# Altium schematic sheet [10] FPGA_ADC_S.SchDoc: FPGA ADC South
size 393 x 281 mm; SheetNumber: 10; SheetTotal: 21; PageSetup: Record=PageOptions|CenterHorizontal=True|CenterVertical=True|PrintScale=0.94|XCorrection=0.00|YCorrection=0.00|PrintKind=0|BorderSize=5000000|LeftOffset=0|BottomOffset=0|Orientation=2|PaperLength=1000|PaperWidth=1000|Scale=100|PaperSource=15|PrintQuality=600|MediaType=1|DitherType=10|PrintScaleMode=1|PaperKind=A4; Adr1: August Barks gata 6B; Adr2: SE-421 32 Västra Frölunda; Adr3: Sweden; Webpage: www.omnisys.se
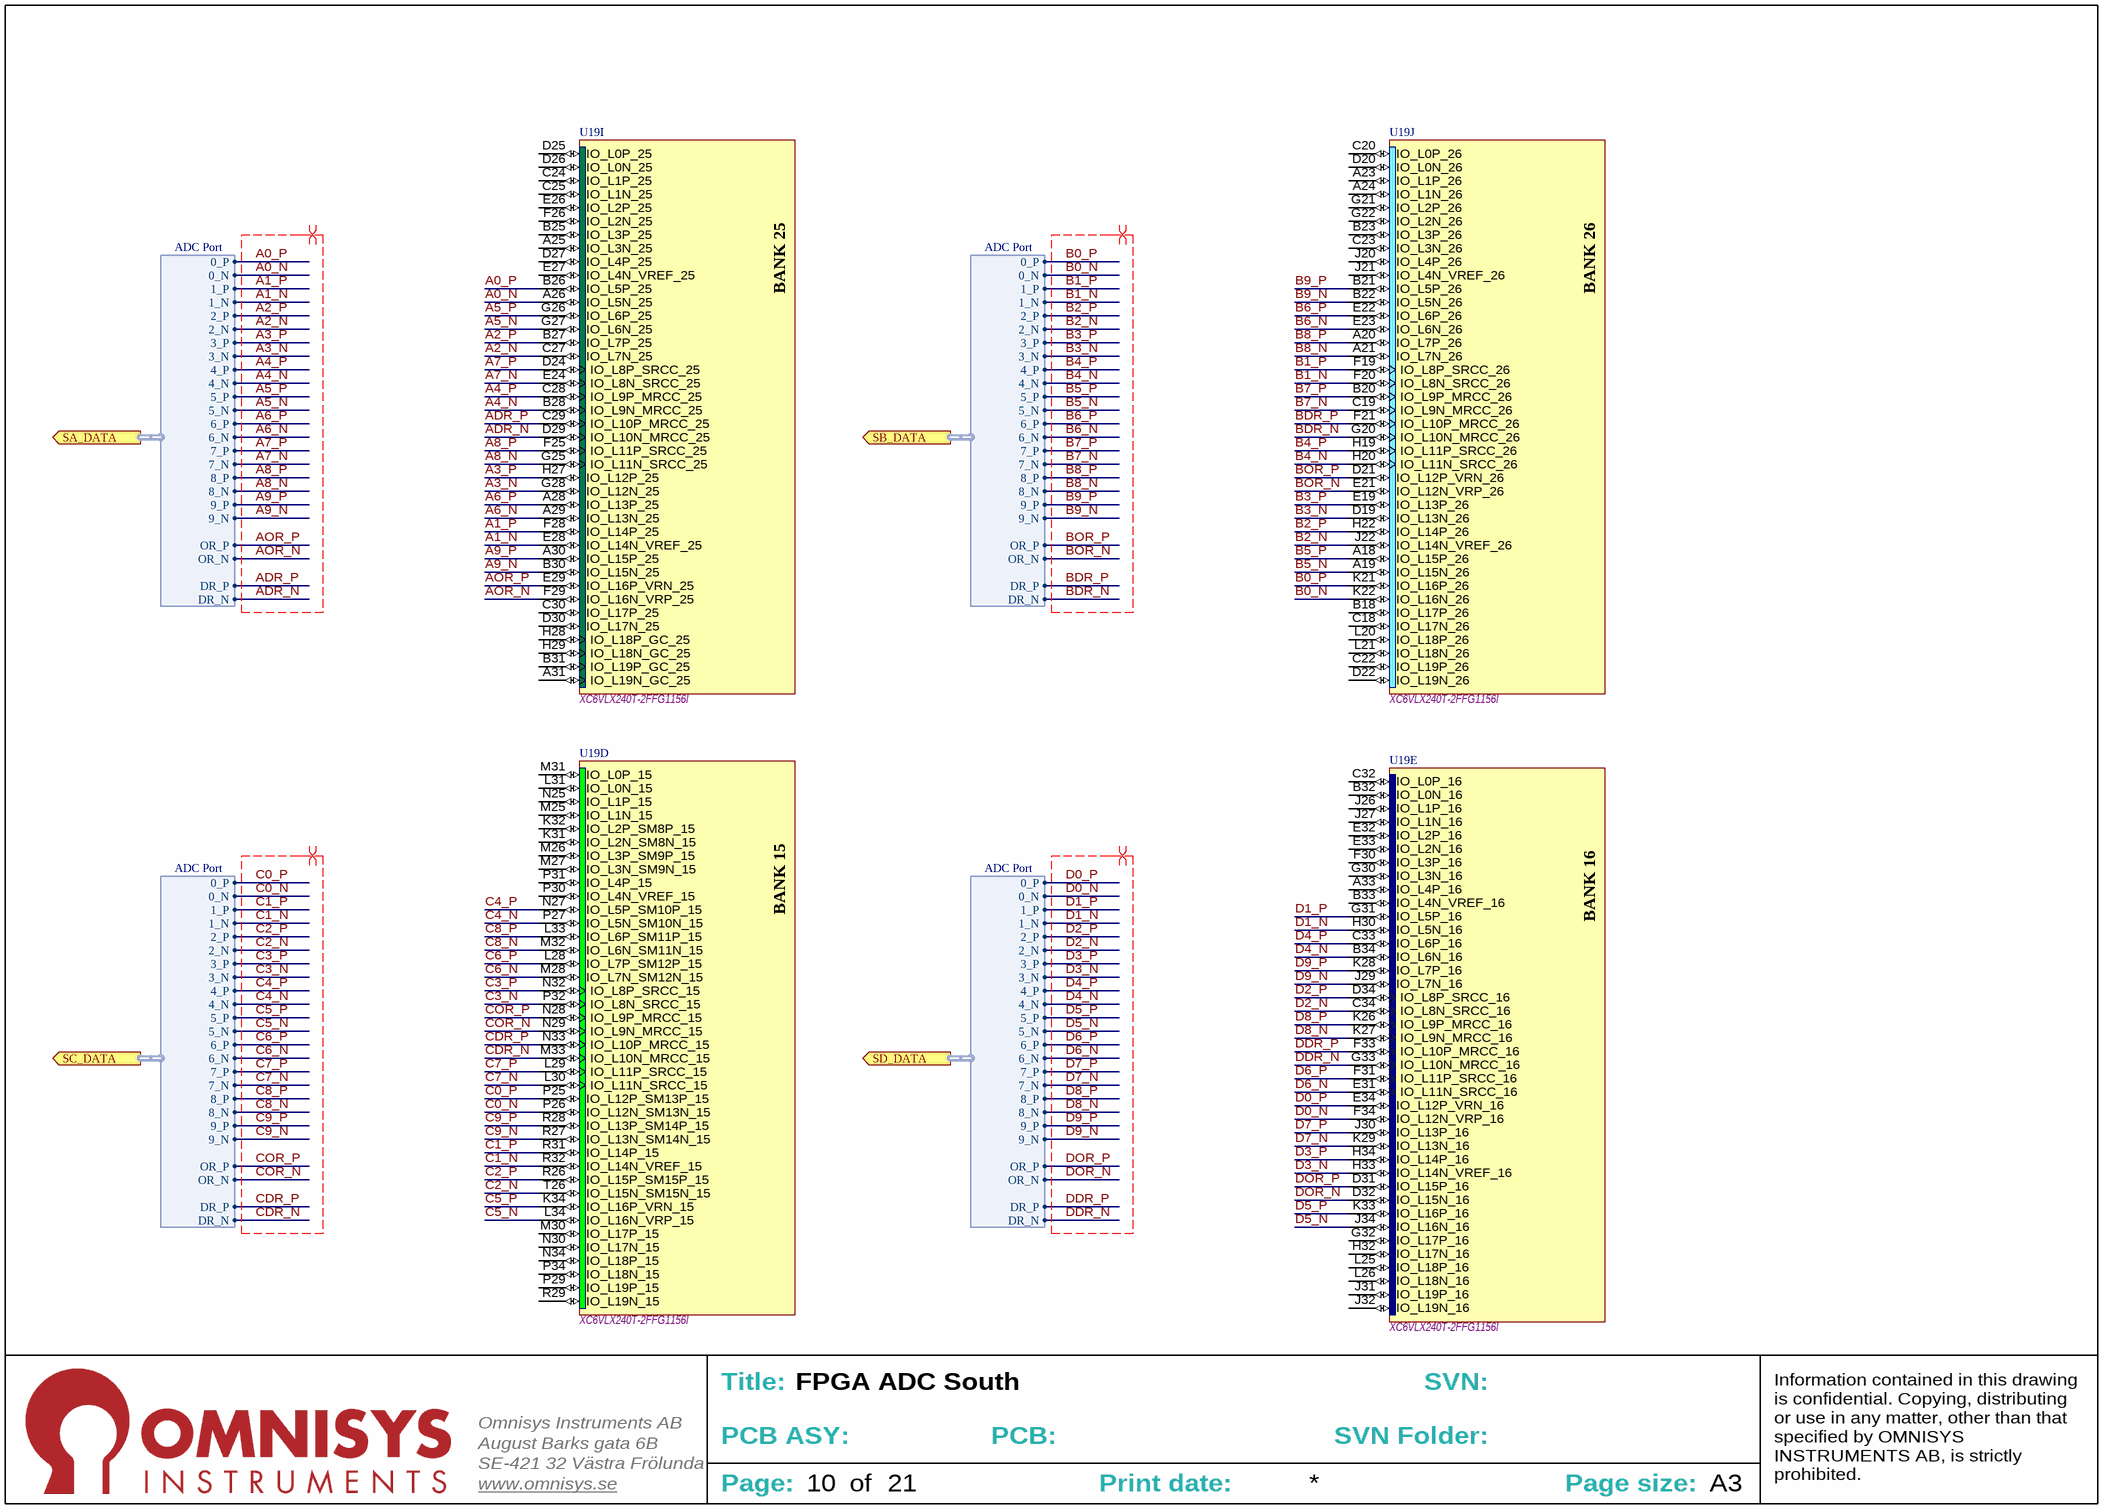
[diagram p0: [10] FPGA_ADC_S.SchDoc]

## Parts
U19  XC6VLX240T-2FFG1156I  [FFG1156]  (parts D,E,I,J of 20)

## Ports
SA_DATA (out, harness ADC Port), SB_DATA (out, harness ADC Port), SC_DATA (out, harness ADC Port), SD_DATA (out, harness ADC Port)

## Harnesses
ADC Port: 0_P, 1_P, 2_P, 3_P, 4_P, 5_P, 6_P, 7_P, 8_P, 9_P, 0_N, 1_N, 2_N, 3_N, 4_N, 5_N, 6_N, 7_N, 8_N, 9_N, OR_P, OR_N, DR_P, DR_N

## Nets
A0_N: U19.A26(IO_L5N_25) ; port SA_DATA.0_N
A0_P: U19.B26(IO_L5P_25) ; port SA_DATA.0_P
A1_N: U19.E28(IO_L14N_VREF_25) ; port SA_DATA.1_N
A1_P: U19.F28(IO_L14P_25) ; port SA_DATA.1_P
A2_N: U19.C27(IO_L7N_25) ; port SA_DATA.2_N
A2_P: U19.B27(IO_L7P_25) ; port SA_DATA.2_P
A3_N: U19.G28(IO_L12N_25) ; port SA_DATA.3_N
A3_P: U19.H27(IO_L12P_25) ; port SA_DATA.3_P
A4_N: U19.B28(IO_L9N_MRCC_25) ; port SA_DATA.4_N
A4_P: U19.C28(IO_L9P_MRCC_25) ; port SA_DATA.4_P
A5_N: U19.G27(IO_L6N_25) ; port SA_DATA.5_N
A5_P: U19.G26(IO_L6P_25) ; port SA_DATA.5_P
A6_N: U19.A29(IO_L13N_25) ; port SA_DATA.6_N
A6_P: U19.A28(IO_L13P_25) ; port SA_DATA.6_P
A7_N: U19.E24(IO_L8N_SRCC_25) ; port SA_DATA.7_N
A7_P: U19.D24(IO_L8P_SRCC_25) ; port SA_DATA.7_P
A8_N: U19.G25(IO_L11N_SRCC_25) ; port SA_DATA.8_N
A8_P: U19.F25(IO_L11P_SRCC_25) ; port SA_DATA.8_P
A9_N: U19.B30(IO_L15N_25) ; port SA_DATA.9_N
A9_P: U19.A30(IO_L15P_25) ; port SA_DATA.9_P
ADR_N: U19.D29(IO_L10N_MRCC_25) ; port SA_DATA.DR_N
ADR_P: U19.C29(IO_L10P_MRCC_25) ; port SA_DATA.DR_P
AOR_N: U19.F29(IO_L16N_VRP_25) ; port SA_DATA.OR_N
AOR_P: U19.E29(IO_L16P_VRN_25) ; port SA_DATA.OR_P
B0_N: U19.K22(IO_L16N_26) ; port SB_DATA.0_N
B0_P: U19.K21(IO_L16P_26) ; port SB_DATA.0_P
B1_N: U19.F20(IO_L8N_SRCC_26) ; port SB_DATA.1_N
B1_P: U19.F19(IO_L8P_SRCC_26) ; port SB_DATA.1_P
B2_N: U19.J22(IO_L14N_VREF_26) ; port SB_DATA.2_N
B2_P: U19.H22(IO_L14P_26) ; port SB_DATA.2_P
B3_N: U19.D19(IO_L13N_26) ; port SB_DATA.3_N
B3_P: U19.E19(IO_L13P_26) ; port SB_DATA.3_P
B4_N: U19.H20(IO_L11N_SRCC_26) ; port SB_DATA.4_N
B4_P: U19.H19(IO_L11P_SRCC_26) ; port SB_DATA.4_P
B5_N: U19.A19(IO_L15N_26) ; port SB_DATA.5_N
B5_P: U19.A18(IO_L15P_26) ; port SB_DATA.5_P
B6_N: U19.E23(IO_L6N_26) ; port SB_DATA.6_N
B6_P: U19.E22(IO_L6P_26) ; port SB_DATA.6_P
B7_N: U19.C19(IO_L9N_MRCC_26) ; port SB_DATA.7_N
B7_P: U19.B20(IO_L9P_MRCC_26) ; port SB_DATA.7_P
B8_N: U19.A21(IO_L7N_26) ; port SB_DATA.8_N
B8_P: U19.A20(IO_L7P_26) ; port SB_DATA.8_P
B9_N: U19.B22(IO_L5N_26) ; port SB_DATA.9_N
B9_P: U19.B21(IO_L5P_26) ; port SB_DATA.9_P
BDR_N: U19.G20(IO_L10N_MRCC_26) ; port SB_DATA.DR_N
BDR_P: U19.F21(IO_L10P_MRCC_26) ; port SB_DATA.DR_P
BOR_N: U19.E21(IO_L12N_VRP_26) ; port SB_DATA.OR_N
BOR_P: U19.D21(IO_L12P_VRN_26) ; port SB_DATA.OR_P
C0_N: U19.P26(IO_L12N_SM13N_15) ; port SC_DATA.0_N
C0_P: U19.P25(IO_L12P_SM13P_15) ; port SC_DATA.0_P
C1_N: U19.R32(IO_L14N_VREF_15) ; port SC_DATA.1_N
C1_P: U19.R31(IO_L14P_15) ; port SC_DATA.1_P
C2_N: U19.T26(IO_L15N_SM15N_15) ; port SC_DATA.2_N
C2_P: U19.R26(IO_L15P_SM15P_15) ; port SC_DATA.2_P
C3_N: U19.P32(IO_L8N_SRCC_15) ; port SC_DATA.3_N
C3_P: U19.N32(IO_L8P_SRCC_15) ; port SC_DATA.3_P
C4_N: U19.P27(IO_L5N_SM10N_15) ; port SC_DATA.4_N
C4_P: U19.N27(IO_L5P_SM10P_15) ; port SC_DATA.4_P
C5_N: U19.L34(IO_L16N_VRP_15) ; port SC_DATA.5_N
C5_P: U19.K34(IO_L16P_VRN_15) ; port SC_DATA.5_P
C6_N: U19.M28(IO_L7N_SM12N_15) ; port SC_DATA.6_N
C6_P: U19.L28(IO_L7P_SM12P_15) ; port SC_DATA.6_P
C7_N: U19.L30(IO_L11N_SRCC_15) ; port SC_DATA.7_N
C7_P: U19.L29(IO_L11P_SRCC_15) ; port SC_DATA.7_P
C8_N: U19.M32(IO_L6N_SM11N_15) ; port SC_DATA.8_N
C8_P: U19.L33(IO_L6P_SM11P_15) ; port SC_DATA.8_P
C9_N: U19.R27(IO_L13N_SM14N_15) ; port SC_DATA.9_N
C9_P: U19.R28(IO_L13P_SM14P_15) ; port SC_DATA.9_P
CDR_N: U19.M33(IO_L10N_MRCC_15) ; port SC_DATA.DR_N
CDR_P: U19.N33(IO_L10P_MRCC_15) ; port SC_DATA.DR_P
COR_N: U19.N29(IO_L9N_MRCC_15) ; port SC_DATA.OR_N
COR_P: U19.N28(IO_L9P_MRCC_15) ; port SC_DATA.OR_P
D0_N: U19.F34(IO_L12N_VRP_16) ; port SD_DATA.0_N
D0_P: U19.E34(IO_L12P_VRN_16) ; port SD_DATA.0_P
D1_N: U19.H30(IO_L5N_16) ; port SD_DATA.1_N
D1_P: U19.G31(IO_L5P_16) ; port SD_DATA.1_P
D2_N: U19.C34(IO_L8N_SRCC_16) ; port SD_DATA.2_N
D2_P: U19.D34(IO_L8P_SRCC_16) ; port SD_DATA.2_P
D3_N: U19.H33(IO_L14N_VREF_16) ; port SD_DATA.3_N
D3_P: U19.H34(IO_L14P_16) ; port SD_DATA.3_P
D4_N: U19.B34(IO_L6N_16) ; port SD_DATA.4_N
D4_P: U19.C33(IO_L6P_16) ; port SD_DATA.4_P
D5_N: U19.J34(IO_L16N_16) ; port SD_DATA.5_N
D5_P: U19.K33(IO_L16P_16) ; port SD_DATA.5_P
D6_N: U19.E31(IO_L11N_SRCC_16) ; port SD_DATA.6_N
D6_P: U19.F31(IO_L11P_SRCC_16) ; port SD_DATA.6_P
D7_N: U19.K29(IO_L13N_16) ; port SD_DATA.7_N
D7_P: U19.J30(IO_L13P_16) ; port SD_DATA.7_P
D8_N: U19.K27(IO_L9N_MRCC_16) ; port SD_DATA.8_N
D8_P: U19.K26(IO_L9P_MRCC_16) ; port SD_DATA.8_P
D9_N: U19.J29(IO_L7N_16) ; port SD_DATA.9_N
D9_P: U19.K28(IO_L7P_16) ; port SD_DATA.9_P
DDR_N: U19.G33(IO_L10N_MRCC_16) ; port SD_DATA.DR_N
DDR_P: U19.F33(IO_L10P_MRCC_16) ; port SD_DATA.DR_P
DOR_N: U19.D32(IO_L15N_16) ; port SD_DATA.OR_N
DOR_P: U19.D31(IO_L15P_16) ; port SD_DATA.OR_P

Not connected (* = marked no-connect by the designer): U19 A23(IO_L1P_26) A24(IO_L1N_26) A25(IO_L3N_25) A31(IO_L19N_GC_25) A33(IO_L4P_16) B18(IO_L17P_26) B23(IO_L3P_26) B25(IO_L3P_25) B31(IO_L19P_GC_25) B32(IO_L0N_16) B33(IO_L4N_VREF_16) C18(IO_L17N_26) C20(IO_L0P_26) C22(IO_L19P_26) C23(IO_L3N_26) C24(IO_L1P_25) C25(IO_L1N_25) C30(IO_L17P_25) C32(IO_L0P_16) D20(IO_L0N_26) D22(IO_L19N_26) D25(IO_L0P_25) D26(IO_L0N_25) D27(IO_L4P_25) D30(IO_L17N_25) E26(IO_L2P_25) E27(IO_L4N_VREF_25) E32(IO_L2P_16) E33(IO_L2N_16) F26(IO_L2N_25) F30(IO_L3P_16) G21(IO_L2P_26) G22(IO_L2N_26) G30(IO_L3N_16) G32(IO_L17P_16) H28(IO_L18P_GC_25) H29(IO_L18N_GC_25) H32(IO_L17N_16) J20(IO_L4P_26) J21(IO_L4N_VREF_26) J26(IO_L1P_16) J27(IO_L1N_16) J31(IO_L19P_16) J32(IO_L19N_16) K31(IO_L2N_SM8N_15) K32(IO_L2P_SM8P_15) L20(IO_L18P_26) L21(IO_L18N_26) L25(IO_L18P_16) L26(IO_L18N_16) L31(IO_L0N_15) M25(IO_L1N_15) M26(IO_L3P_SM9P_15) M27(IO_L3N_SM9N_15) M30(IO_L17P_15) M31(IO_L0P_15) N25(IO_L1P_15) N30(IO_L17N_15) N34(IO_L18P_15) P29(IO_L19P_15) P30(IO_L4N_VREF_15) P31(IO_L4P_15) P34(IO_L18N_15) R29(IO_L19N_15)

## Layout directives
differential pair; rule Differential Pairs Routing [Pref Gap = 0.1mm    Min Gap  = 0.1mm    Max Gap  = 0.1mmPref Width = 0.1mm    Min Width  = 0.1mm    Max Width  = 0.1mm]; net class DiffPairs_FPGA: A0_N, A0_P, A1_N, A1_P, A2_N, A2_P, A3_N, A3_P, A4_N, A4_P, A5_N, A5_P, A6_N, A6_P, A7_N, A7_P, A8_N, A8_P, A9_N, A9_P, ADR_N, ADR_P, AOR_N, AOR_P, B0_N, B0_P, B1_N, B1_P, B2_N, B2_P, B3_N, B3_P, B4_N, B4_P, B5_N, B5_P, B6_N, B6_P, B7_N, B7_P, B8_N, B8_P, B9_N, B9_P, BDR_N, BDR_P, BOR_N, BOR_P, C0_N, C0_P, C1_N, C1_P, C2_N, C2_P, C3_N, C3_P, C4_N, C4_P, C5_N, C5_P, C6_N, C6_P, C7_N, C7_P, C8_N, C8_P, C9_N, C9_P, CDR_N, CDR_P, COR_N, COR_P, D0_N, D0_P, D1_N, D1_P, D2_N, D2_P, D3_N, D3_P, D4_N, D4_P, D5_N, D5_P, D6_N, D6_P, D7_N, D7_P, D8_N, D8_P, D9_N, D9_P, DDR_N, DDR_P, DOR_N, DOR_P

## Notes on the sheet
- Title:
- SVN:
- August Barks gata 6B
- SE-421 32 Västra Frölunda
- Omnisys Instruments AB
- PCB ASY:
- PCB:
- SVN Folder:
- www.omnisys.se
- Page:
- of
- Print date:
- Page size:
- A3
- Information contained in this drawing is confidential. Copying, distributing or use in any matter, other than that specified by OMNISYS INSTRUMENTS AB, is strictly prohibited.
- (in symbol CMP-2100-000586-1, part D) BANK 15
- (in symbol CMP-2100-000586-1, part E) BANK 16
- (in symbol CMP-2100-000586-1, part I) BANK 25
- (in symbol CMP-2100-000586-1, part J) BANK 26

## Library data of the parts
U19 = CMP-2100-000586-1: FPGA Virtex-6 LXT Family 241152 Cells 40nm (CMOS) Technology 1V 1156-Pin FCBGA; Number of I/Os: 600; Number of Logic Blocks (LABs): 18840; Number of Logic Elements/Cells: 241152; RAM Size: 15335424b; Speed Grade: 2; Case/Package: FCBGA; Max Operating Temperature: 100°C; Min Operating Temperature: -40°C; Mount: Surface Mount; Number of Pins: 1156; Operating Supply Voltage: 1V; Package Quantity: 1